# Altium schematic sheet 14_Zynq Power.SchDoc
size A3; SheetNumber: 14; SheetTotal: 14
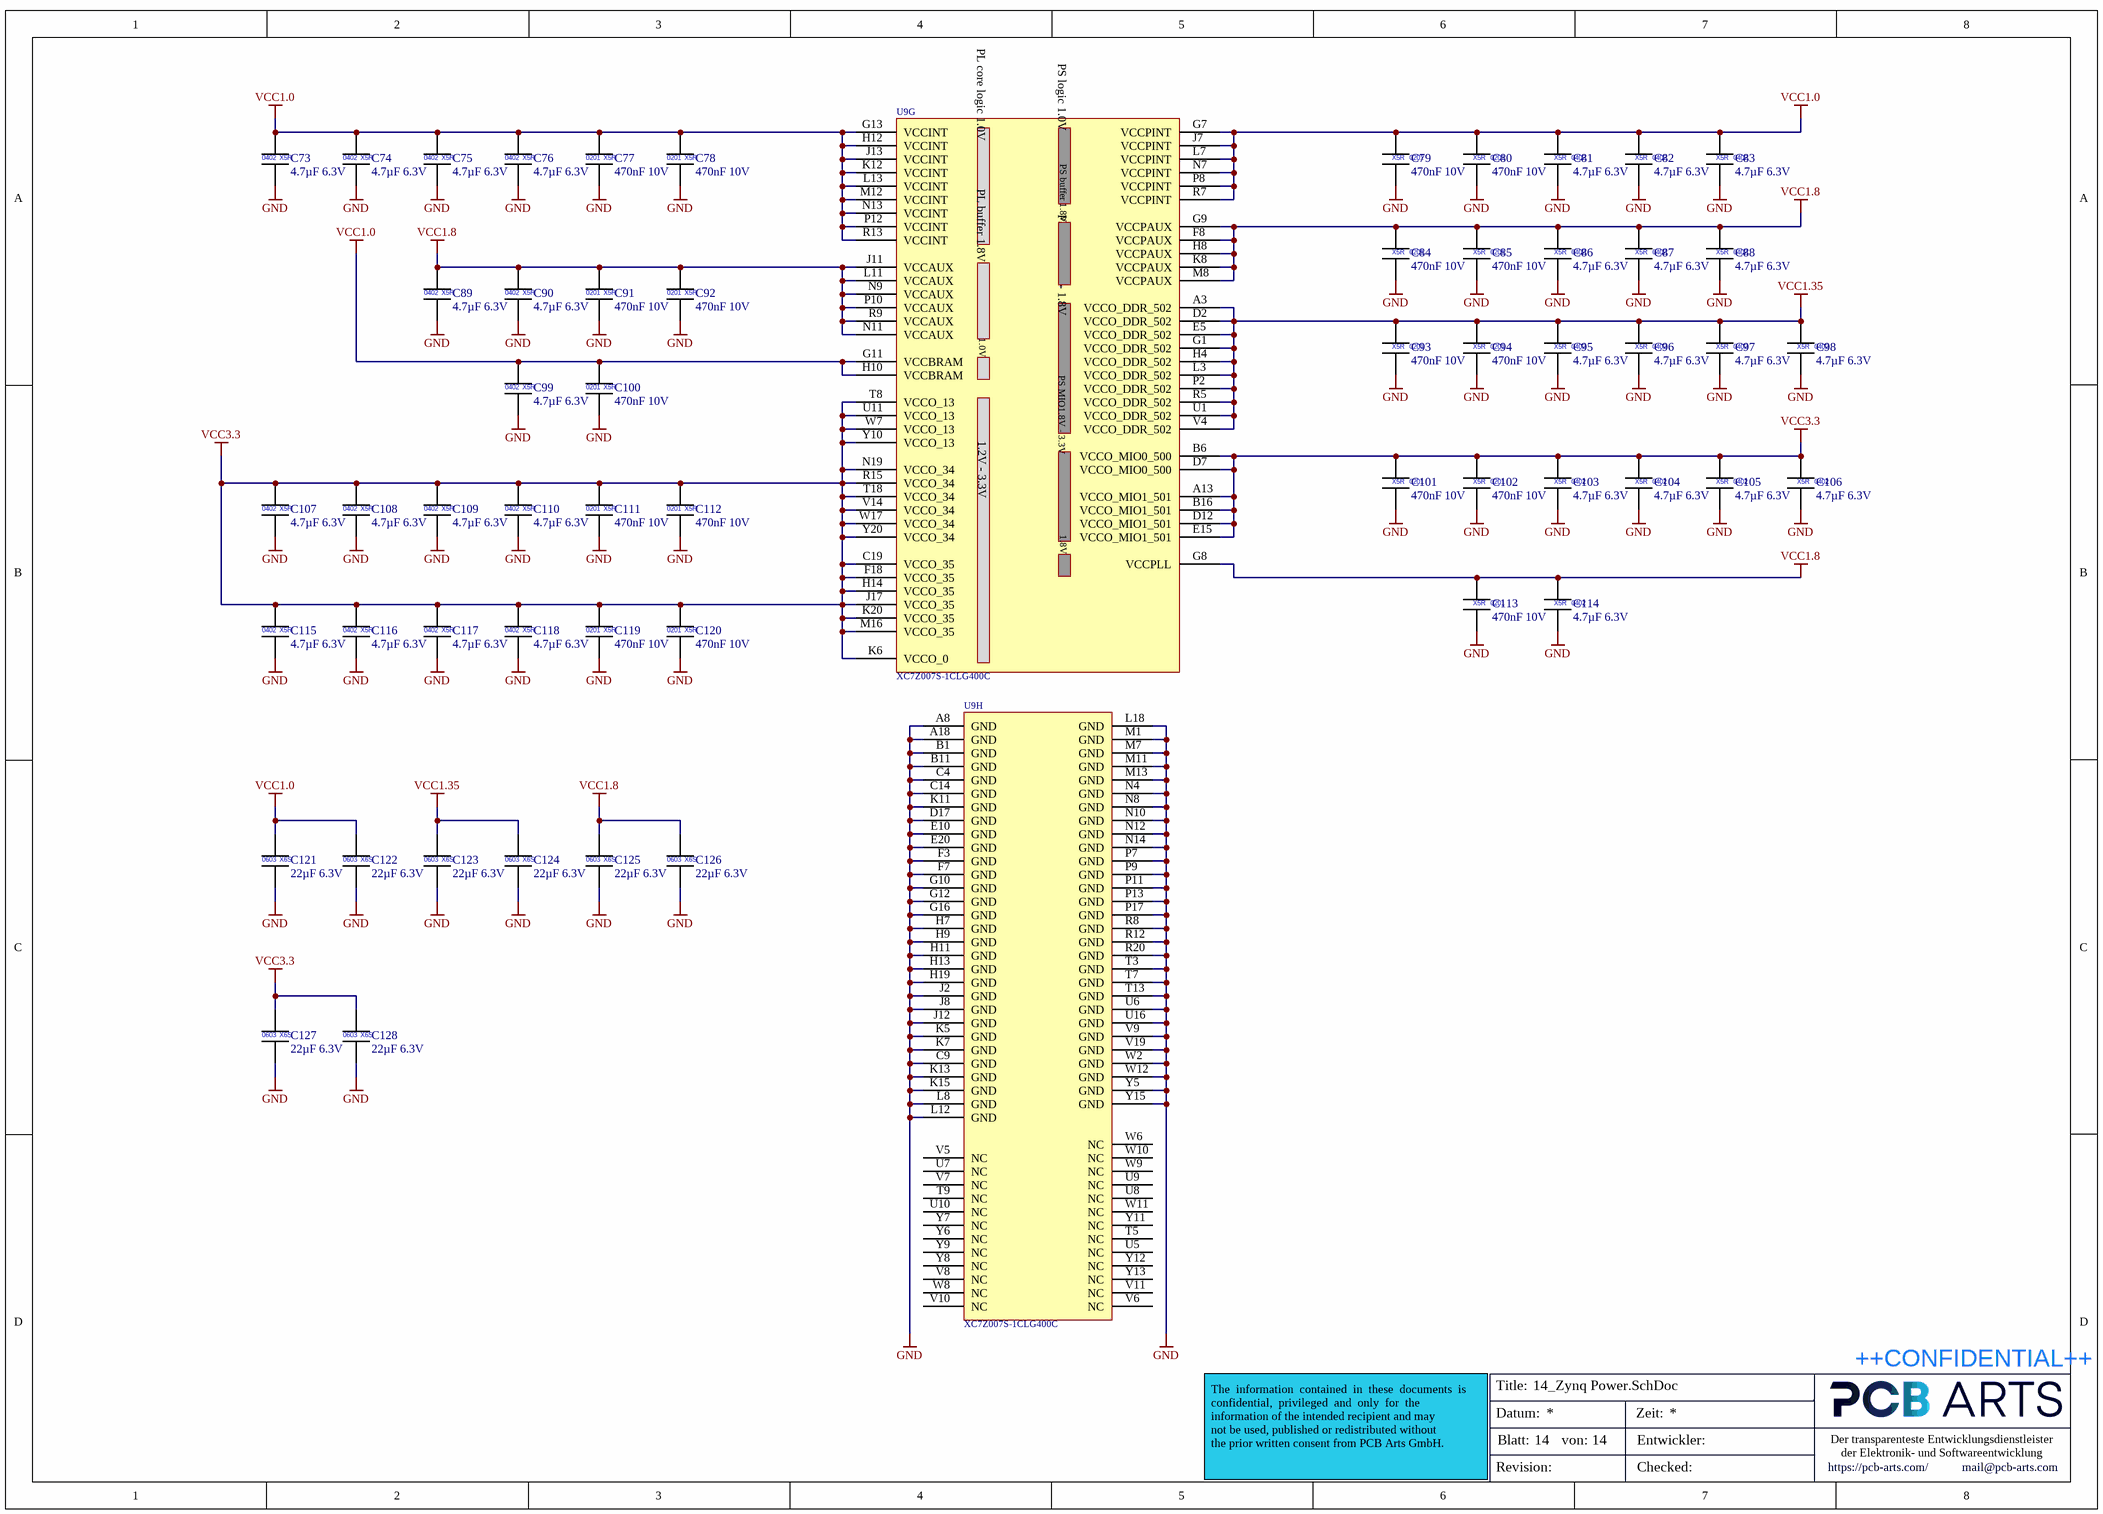
[diagram p0: 14_Zynq Power.SchDoc]

## Parts
C73  4.7µF 6.3V  [CAPC1005X06L]
C74  4.7µF 6.3V  [CAPC1005X06L]
C75  4.7µF 6.3V  [CAPC1005X06L]
C76  4.7µF 6.3V  [CAPC1005X06L]
C77  470nF 10V  [CAPC0603X03L]
C78  470nF 10V  [CAPC0603X03L]
C79  470nF 10V  [CAPC0603X03L]
C80  470nF 10V  [CAPC0603X03L]
C81  4.7µF 6.3V  [CAPC1005X06L]
C82  4.7µF 6.3V  [CAPC1005X06L]
C83  4.7µF 6.3V  [CAPC1005X06L]
C84  470nF 10V  [CAPC0603X03L]
C85  470nF 10V  [CAPC0603X03L]
C86  4.7µF 6.3V  [CAPC1005X06L]
C87  4.7µF 6.3V  [CAPC1005X06L]
C88  4.7µF 6.3V  [CAPC1005X06L]
C89  4.7µF 6.3V  [CAPC1005X06L]
C90  4.7µF 6.3V  [CAPC1005X06L]
C91  470nF 10V  [CAPC0603X03L]
C92  470nF 10V  [CAPC0603X03L]
C93  470nF 10V  [CAPC0603X03L]
C94  470nF 10V  [CAPC0603X03L]
C95  4.7µF 6.3V  [CAPC1005X06L]
C96  4.7µF 6.3V  [CAPC1005X06L]
C97  4.7µF 6.3V  [CAPC1005X06L]
C98  4.7µF 6.3V  [CAPC1005X06L]
C99  4.7µF 6.3V  [CAPC1005X06L]
C100  470nF 10V  [CAPC0603X03L]
C101  470nF 10V  [CAPC0603X03L]
C102  470nF 10V  [CAPC0603X03L]
C103  4.7µF 6.3V  [CAPC1005X06L]
C104  4.7µF 6.3V  [CAPC1005X06L]
C105  4.7µF 6.3V  [CAPC1005X06L]
C106  4.7µF 6.3V  [CAPC1005X06L]
C107  4.7µF 6.3V  [CAPC1005X06L]
C108  4.7µF 6.3V  [CAPC1005X06L]
C109  4.7µF 6.3V  [CAPC1005X06L]
C110  4.7µF 6.3V  [CAPC1005X06L]
C111  470nF 10V  [CAPC0603X03L]
C112  470nF 10V  [CAPC0603X03L]
C113  470nF 10V  [CAPC0603X03L]
C114  4.7µF 6.3V  [CAPC1005X06L]
C115  4.7µF 6.3V  [CAPC1005X06L]
C116  4.7µF 6.3V  [CAPC1005X06L]
C117  4.7µF 6.3V  [CAPC1005X06L]
C118  4.7µF 6.3V  [CAPC1005X06L]
C119  470nF 10V  [CAPC0603X03L]
C120  470nF 10V  [CAPC0603X03L]
C121  22µF 6.3V  [CAPC1608X10L]
C122  22µF 6.3V  [CAPC1608X10L]
C123  22µF 6.3V  [CAPC1608X10L]
C124  22µF 6.3V  [CAPC1608X10L]
C125  22µF 6.3V  [CAPC1608X10L]
C126  22µF 6.3V  [CAPC1608X10L]
C127  22µF 6.3V  [CAPC1608X10L]
C128  22µF 6.3V  [CAPC1608X10L]
U9  XC7Z007S-1CLG400C  [BGA400C80P20X20_1700X1700X160]  (parts G,H of 8)

## Nets
GND: C73.2 C74.2 C75.2 C76.2 C77.2 C78.2 C79.2 C80.2 C81.2 C82.2 C83.2 C84.2 C85.2 C86.2 C87.2 C88.2 C89.2 C90.2 C91.2 C92.2 C93.2 C94.2 C95.2 C96.2 C97.2 C98.2 C99.2 C100.2 C101.2 C102.2 C103.2 C104.2 C105.2 C106.2 C107.2 C108.2 C109.2 C110.2 C111.2 C112.2 C113.2 C114.2 C115.2 C116.2 C117.2 C118.2 C119.2 C120.2 C121.2 C122.2 C123.2 C124.2 C125.2 C126.2 C127.2 C128.2 U9.A8(GND) U9.A18(GND) U9.B1(GND) U9.B11(GND) U9.C4(GND) U9.C9(GND) U9.C14(GND) U9.D17(GND) U9.E10(GND) U9.E20(GND) U9.F3(GND) U9.F7(GND) U9.G10(GND) U9.G12(GND) U9.G16(GND) U9.H7(GND) U9.H9(GND) U9.H11(GND) U9.H13(GND) U9.H19(GND) U9.J2(GND) U9.J8(GND) U9.J12(GND) U9.K5(GND) U9.K7(GND) U9.K11(GND) U9.K13(GND) U9.K15(GND) U9.L8(GND) U9.L12(GND) U9.L18(GND) U9.M1(GND) U9.M7(GND) U9.M11(GND) U9.M13(GND) U9.N4(GND) U9.N8(GND) U9.N10(GND) U9.N12(GND) U9.N14(GND) U9.P7(GND) U9.P9(GND) U9.P11(GND) U9.P13(GND) U9.P17(GND) U9.R8(GND) U9.R12(GND) U9.R20(GND) U9.T3(GND) U9.T7(GND) U9.T13(GND) U9.U6(GND) U9.U16(GND) U9.V9(GND) U9.V19(GND) U9.W2(GND) U9.W12(GND) U9.Y5(GND) U9.Y15(GND)
VCC1.0: C73.1 C74.1 C75.1 C76.1 C77.1 C78.1 C79.1 C80.1 C81.1 C82.1 C83.1 C99.1 C100.1 C121.1 C122.1 U9.G7(VCCPINT) U9.G11(VCCBRAM) U9.G13(VCCINT) U9.H10(VCCBRAM) U9.H12(VCCINT) U9.J7(VCCPINT) U9.J13(VCCINT) U9.K12(VCCINT) U9.L7(VCCPINT) U9.L13(VCCINT) U9.M12(VCCINT) U9.N7(VCCPINT) U9.N13(VCCINT) U9.P8(VCCPINT) U9.P12(VCCINT) U9.R7(VCCPINT) U9.R13(VCCINT)
VCC1.8: C84.1 C85.1 C86.1 C87.1 C88.1 C89.1 C90.1 C91.1 C92.1 C113.1 C114.1 C125.1 C126.1 U9.F8(VCCPAUX) U9.G8(VCCPLL) U9.G9(VCCPAUX) U9.H8(VCCPAUX) U9.J11(VCCAUX) U9.K8(VCCPAUX) U9.L11(VCCAUX) U9.M8(VCCPAUX) U9.N9(VCCAUX) U9.N11(VCCAUX) U9.P10(VCCAUX) U9.R9(VCCAUX)
VCC1.35: C93.1 C94.1 C95.1 C96.1 C97.1 C98.1 C123.1 C124.1 U9.A3(VCCO_DDR_502) U9.D2(VCCO_DDR_502) U9.E5(VCCO_DDR_502) U9.G1(VCCO_DDR_502) U9.H4(VCCO_DDR_502) U9.L3(VCCO_DDR_502) U9.P2(VCCO_DDR_502) U9.R5(VCCO_DDR_502) U9.U1(VCCO_DDR_502) U9.V4(VCCO_DDR_502)
VCC3.3: C101.1 C102.1 C103.1 C104.1 C105.1 C106.1 C107.1 C108.1 C109.1 C110.1 C111.1 C112.1 C115.1 C116.1 C117.1 C118.1 C119.1 C120.1 C127.1 C128.1 U9.A13(VCCO_MIO1_501) U9.B6(VCCO_MIO0_500) U9.B16(VCCO_MIO1_501) U9.C19(VCCO_35) U9.D7(VCCO_MIO0_500) U9.D12(VCCO_MIO1_501) U9.E15(VCCO_MIO1_501) U9.F18(VCCO_35) U9.H14(VCCO_35) U9.J17(VCCO_35) U9.K6(VCCO_0) U9.K20(VCCO_35) U9.M16(VCCO_35) U9.N19(VCCO_34) U9.R15(VCCO_34) U9.T8(VCCO_13) U9.T18(VCCO_34) U9.U11(VCCO_13) U9.V14(VCCO_34) U9.W7(VCCO_13) U9.W17(VCCO_34) U9.Y10(VCCO_13) U9.Y20(VCCO_34)

Not connected (* = marked no-connect by the designer): U9 T5(NC) T9(NC) U5(NC) U7(NC) U8(NC) U9(NC) U10(NC) V5(NC) V6(NC) V7(NC) V8(NC) V10(NC) V11(NC) W6(NC) W8(NC) W9(NC) W10(NC) W11(NC) Y6(NC) Y7(NC) Y8(NC) Y9(NC) Y11(NC) Y12(NC) Y13(NC)

## Notes on the sheet
- Title:
- ++CONFIDENTIAL++
- Datum:
- Blatt:
- von:
- Zeit:
- Entwickler:
- Der transparenteste Entwicklungsdienstleister
  der Elektronik- und Softwareentwicklung
- The  information  contained  in  these  documents  is  confidential,  privileged  and  only  for  the
  information of the intended recipient and may
  not be used, published or redistributed without
  the prior written consent from PCB Arts GmbH.
- Revision:
- Checked:
- https://pcb-arts.com/
- mail@pcb-arts.com
- (in symbol CAP_0201_470nF_10V) 0201; X5R
- (in symbol CAP_0402_4.7µ_6.3V) 0402; X5R
- (in symbol CAP_0603_22µ_6.3V) 0603; X6S
- (in symbol XC7Z007S-1CLG400C_Processors - Application Specialised, part G) PS logic 1.0V; PL core logic 1.0V; PS buffer 1.8V; PL buffer 1.8V; PS DDR 1.2V - 1.8V; 1.0V; PS MIO1.8V - 3.3V; 1.2V - 3.3V; 1.8V

## Library data of the parts
C73-C76 C81-C83 C86-C90 C95-C99 C103-C110 C114-C118 = CAP_0402_4.7µ_6.3V: Multilayer Ceramic Capacitors MLCC - SMD/SMT 0402 6.3VDC; Manufacturer 1: Murata Electronics; Manufacturer 1 Prt. Nr.: GRM155R60J475ME47D; Manufacturer 2 Prt. Nr.: JMK105BC6475MV-F; Manufacturer 2: Taiyo Yuden
C77-C80 C84 C85 C91-C94 C100-C102 C111-C113 C119 C120 = CAP_0201_470nF_10V: Multilayer Ceramic Capacitors MLCC - SMD/SMT 0201 10VDC; Manufacturer 1: Taiyo Yuden; Manufacturer 1 Prt. Nr.: LMK063BBJ474KPLF; Manufacturer 2 Prt. Nr.: C0603X5R1A474M030BC; Manufacturer 2: TDK
C121-C128 = CAP_0603_22µ_6.3V: Multilayer Ceramic Capacitors MLCC - SMD/SMT 0603 6.3VDC; Manufacturer 1: Yageo; Manufacturer 1 Prt. Nr.: CC0603MRX6S5BB226; Manufacturer 2 Prt. Nr.: GRM188C80J226ME15D; Manufacturer 2: Murata Electronics
U9 = XC7Z007S-1CLG400C_Processors - Application Specialised: Manufacturer 1: Xilinx; Manufacturer 1 Prt. Nr.: XC7Z007S-1CLG400C